# EAGLE schematic SolarTracker-EagleProject (EAGLE 7.7.0)
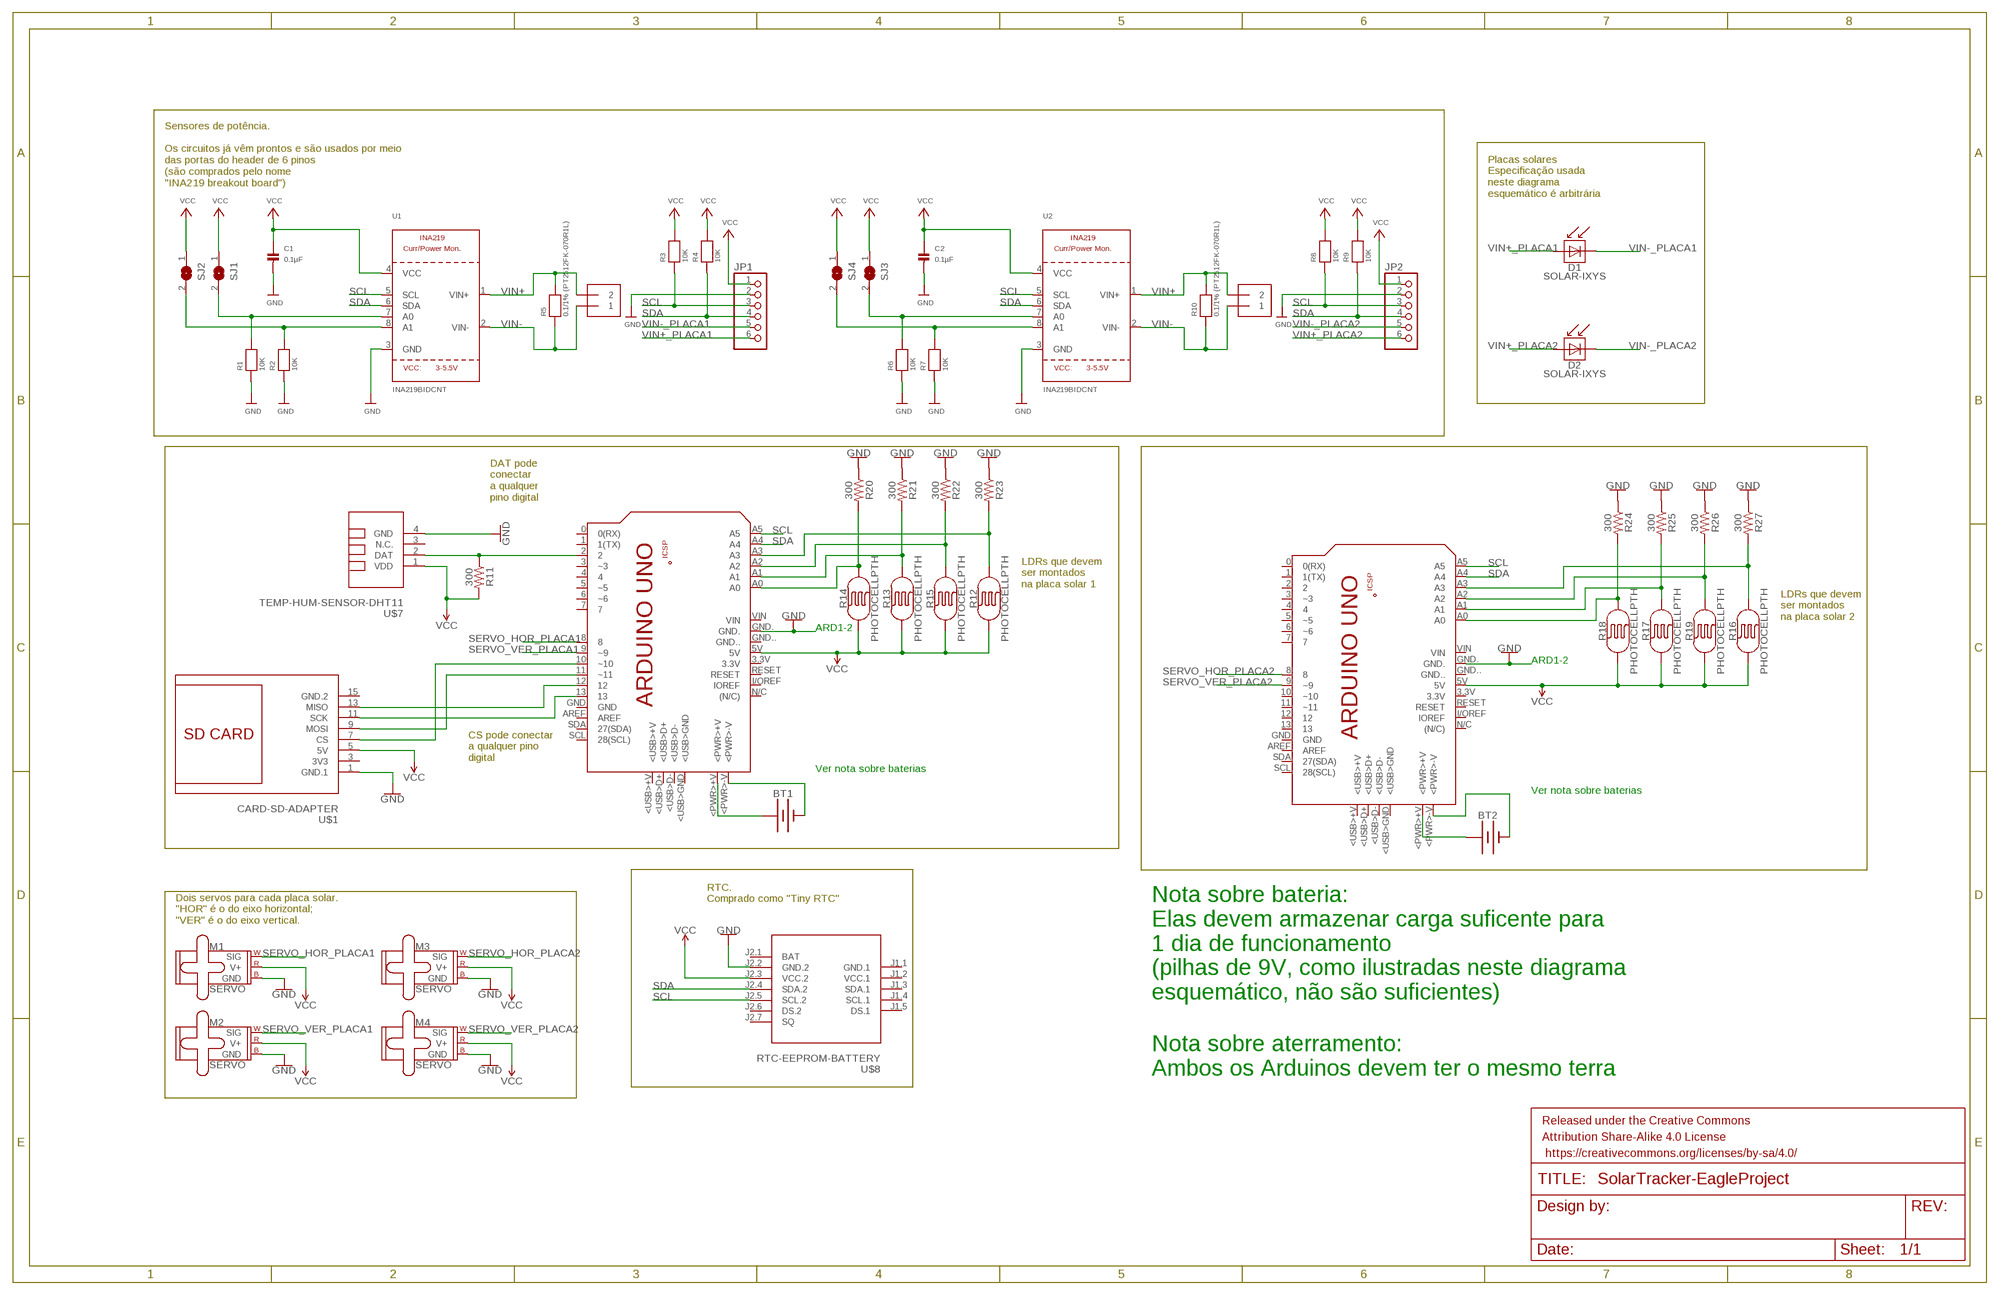
[diagram p0: schematic, sheet 1]

## Parts
BT1  BATTERY-9V  [BATTCON_9V]
BT2  BATTERY-9V  [BATTCON_9V]
C1  0.1µF  CAP_CERAMIC0805  [0805]
C2  0.1µF  CAP_CERAMIC0805  [0805]
D1  SOLAR-IXYS  [SOIC-8]
D2  SOLAR-IXYS  [SOIC-8]
FRAME1  FRAME-LETTER  [CREATIVE_COMMONS]
J1  TERMBLOCK_1X2-3.5MM  [1X2-3.5MM]
J2  TERMBLOCK_1X2-3.5MM  [1X2-3.5MM]
JP1  HEADER-1X670MIL  [1X06_ROUND_70]
JP2  HEADER-1X670MIL  [1X06_ROUND_70]
M1  SERVO  [1X03]
M2  SERVO  [1X03]
M3  SERVO  [1X03]
M4  SERVO  [1X03]
PCB1  ARDUINO_UNO  [ARDUINO_UNO]
PCB2  ARDUINO_UNO  [ARDUINO_UNO]
R1  10K  RESISTOR0805  [0805]
R2  10K  RESISTOR0805  [0805]
R3  10K  RESISTOR0805  [0805]
R4  10K  RESISTOR0805  [0805]
R5  0.1/1% (PT2512FK-070R1L)  RESISTOR2512  [2512]
R6  10K  RESISTOR0805  [0805]
R7  10K  RESISTOR0805  [0805]
R8  10K  RESISTOR0805  [0805]
R9  10K  RESISTOR0805  [0805]
R10  0.1/1% (PT2512FK-070R1L)  RESISTOR2512  [2512]
R11  300  300OHM-0603-1/10W-1%  [0603]
R12  PHOTOCELLPTH  [PHOTOCELL]
R13  PHOTOCELLPTH  [PHOTOCELL]
R14  PHOTOCELLPTH  [PHOTOCELL]
R15  PHOTOCELLPTH  [PHOTOCELL]
R16  PHOTOCELLPTH  [PHOTOCELL]
R17  PHOTOCELLPTH  [PHOTOCELL]
R18  PHOTOCELLPTH  [PHOTOCELL]
R19  PHOTOCELLPTH  [PHOTOCELL]
R20  300  300OHM-0603-1/10W-1%  [0603]
R21  300  300OHM-0603-1/10W-1%  [0603]
R22  300  300OHM-0603-1/10W-1%  [0603]
R23  300  300OHM-0603-1/10W-1%  [0603]
R24  300  300OHM-0603-1/10W-1%  [0603]
R25  300  300OHM-0603-1/10W-1%  [0603]
R26  300  300OHM-0603-1/10W-1%  [0603]
R27  300  300OHM-0603-1/10W-1%  [0603]
SJ1  SOLDERJUMPERREFLOW_NOPASTE  [SOLDERJUMPER_REFLOW_NOPASTE]
SJ2  SOLDERJUMPERREFLOW_NOPASTE  [SOLDERJUMPER_REFLOW_NOPASTE]
SJ3  SOLDERJUMPERREFLOW_NOPASTE  [SOLDERJUMPER_REFLOW_NOPASTE]
SJ4  SOLDERJUMPERREFLOW_NOPASTE  [SOLDERJUMPER_REFLOW_NOPASTE]
U1  INA219BIDCNT  INA219  [SOT23-8]
U2  INA219BIDCNT  INA219  [SOT23-8]
U$1  CARD-SD-ADAPTER  [CARD-SD-ADAPTER]
U$7  TEMP-HUM-SENSOR-DHT11  [TEMP-HUM-SENSOR-DHT11]
U$8  RTC-EEPROM-BATTERY  [RTC-EEPROM-BATTERY]

## Nets
GND: C1.2 C2.2 JP1.2 JP2.2 M1.3(GND) M2.3(GND) M3.3(GND) M4.3(GND) PCB1.GND. PCB2.GND. R1.1 R2.1 R6.1 R7.1 R20.1 R21.1 R22.1 R23.1 R24.1 R25.1 R26.1 R27.1 U1.3(GND) U2.3(GND) U$1.1(GND.1) U$7.4(GND) U$8.J2.2(GND.2)
N$1: R2.2 SJ2.2 U1.8(A1)
N$2: R1.2 SJ1.2 U1.7(A0)
N$3: R7.2 SJ4.2 U2.8(A1)
N$4: R6.2 SJ3.2 U2.7(A0)
N$5: PCB1.13 U$1.11(SCK)
N$6: PCB1.12 U$1.13(MISO)
N$7: PCB1.11(~11) U$1.9(MOSI)
N$8: PCB1.10(~10) U$1.7(CS)
N$9: PCB1.2 R11.1 U$7.2(DAT)
N$10: PCB1.A0 R14.2 R20.2
N$11: PCB1.A1 R13.2 R21.2
N$12: BT2.+ PCB2.<PWR>+V
N$13: BT2.- PCB2.<PWR>-V
N$14: BT1.+ PCB1.<PWR>+V
N$15: BT1.- PCB1.<PWR>-V
N$16: PCB1.A2 R15.2 R22.2
N$17: PCB1.A3 R12.2 R23.2
N$18: PCB2.A0 R18.2 R24.2
N$19: PCB2.A1 R17.2 R25.2
N$20: PCB2.A2 R19.2 R26.2
N$21: PCB2.A3 R16.2 R27.2
SCL: JP1.3 JP2.3 PCB1.A5 PCB2.A5 R3.1 R8.1 U1.5(SCL) U2.5(SCL) U$8.J2.5(SCL.2)
SDA: JP1.4 JP2.4 PCB1.A4 PCB2.A4 R4.1 R9.1 U1.6(SDA) U2.6(SDA) U$8.J2.4(SDA.2)
SERVO_HOR_PLACA1: M1.1(SIG) PCB1.8
SERVO_HOR_PLACA2: M3.1(SIG) PCB2.8
SERVO_VER_PLACA1: M2.1(SIG) PCB1.9(~9)
SERVO_VER_PLACA2: M4.1(SIG) PCB2.9(~9)
VCC: C1.1 C2.1 JP1.1 JP2.1 M1.2(V+) M2.2(V+) M3.2(V+) M4.2(V+) PCB1.5V PCB2.5V R3.2 R4.2 R8.2 R9.2 R11.2 R12.1 R13.1 R14.1 R15.1 R16.1 R17.1 R18.1 R19.1 SJ1.1 SJ2.1 SJ3.1 SJ4.1 U1.4(VCC) U2.4(VCC) U$1.5(5V) U$7.1(VDD) U$8.J2.3(VCC.2)
VIN+: J1.2 J2.2 R5.2 R10.2 U1.1(VIN+) U2.1(VIN+)
VIN+_PLACA1: D1.8(A) JP1.6
VIN+_PLACA2: D2.8(A) JP2.6
VIN-: J1.1 J2.1 R5.1 R10.1 U1.2(VIN-) U2.2(VIN-)
VIN-_PLACA1: D1.5(C) JP1.5
VIN-_PLACA2: D2.5(C) JP2.5
Unconnected: PCB1.0(0(RX)) PCB1.1(1(TX)) PCB1.3(~3) PCB1.3.3V PCB1.4 PCB1.5(~5) PCB1.6(~6) PCB1.7 PCB1.+5V PCB1.<USB>+V PCB1.<USB>D+ PCB1.<USB>D- PCB1.<USB>GND PCB1.AREF PCB1.GND PCB1.GND.. PCB1.GND_ PCB1.I/OREF(IOREF) PCB1.MISO PCB1.MOSI PCB1.N/C((N/C)) PCB1.RESET PCB1.RESET. PCB1.SCK PCB1.SCL(28(SCL)) PCB1.SDA(27(SDA)) PCB1.VIN PCB2.0(0(RX)) PCB2.1(1(TX)) PCB2.2 PCB2.3(~3) PCB2.3.3V PCB2.4 PCB2.5(~5) PCB2.6(~6) PCB2.7 PCB2.10(~10) PCB2.11(~11) PCB2.12 PCB2.13 PCB2.+5V PCB2.<USB>+V PCB2.<USB>D+ PCB2.<USB>D- PCB2.<USB>GND PCB2.AREF PCB2.GND PCB2.GND.. PCB2.GND_ PCB2.I/OREF(IOREF) PCB2.MISO PCB2.MOSI PCB2.N/C((N/C)) PCB2.RESET PCB2.RESET. PCB2.SCK PCB2.SCL(28(SCL)) PCB2.SDA(27(SDA)) PCB2.VIN U$7.3(N.C.) U$8.J1.3(SDA.1) U$8.J1.4(SCL.1) U$8.J1.5(DS.1) U$8.J2.1(BAT) U$8.J2.6(DS.2) U$8.J2.7(SQ)

## Notes on the sheet
- Sensores de potência. 
  
  Os circuitos já vêm prontos e são usados por meio
  das portas do header de 6 pinos 
  (são comprados pelo nome 
  "INA219 breakout board")
- Placas solares
  Especificação usada 
  neste diagrama 
  esquemático é arbitrária
- DAT pode 
  conectar
  a qualquer
  pino digital
- LDRs que devem
  ser montados 
  na placa solar 1
- LDRs que devem
  ser montados 
  na placa solar 2
- ARD1-2
- ARD1-2
- CS pode conectar
  a qualquer pino
  digital
- Ver nota sobre baterias
- Ver nota sobre baterias
- RTC.
  Comprado como "Tiny RTC"
- Dois servos para cada placa solar.
  "HOR" é o do eixo horizontal;
  "VER" é o do eixo vertical.
- Nota sobre bateria: 
  Elas devem armazenar carga suficente para 
  1 dia de funcionamento 
  (pilhas de 9V, como ilustradas neste diagrama
  esquemático, não são suficientes)
- Nota sobre aterramento:
  Ambos os Arduinos devem ter o mesmo terra

## Power pins joined to a net without a drawn wire
3V3: U$1.3(3V3)
GND.1: U$8.J1.1(GND.1)
GND.2: U$1.15(GND.2)
VCC.1: U$8.J1.2(VCC.1)

## Library data of the parts
BT1 BT2 = SparkFun-Batteries:BATTERY: Battery - Single Cell A variety of battery chemistries, sizes, and footprints. Device List: 20MM_PTH - Coin Cell Battery Holder - 20mm (PTH) <https://www.sparkfun.com/products/783> 6.8MM_PTH - Coin Cell Battery Holder - 6.8MM(SMD) <https://www.digikey.com/product-detail/en/seiko-instruments/MS621FE-FL11E/728-1057-ND/1889208?WT.srch=1&gclid=CNOQ5a6LzdQCFZS2wAodXCkE0g> 12MM_SMD - Coin Cell Battery Holder - 12mm (SMD) <https://www.sparkfun.com/products/10592> 12MM_PTH - Coin Cell Battery Holder - 12mm (PTH) <https://www.sparkfun.com/products/7948> 20MM_SMD - 20mm Coin Cell Battery Holder (SMD) (2 legs) Used on the Big Time Watch Kit <https://www.sparkfun.com/products/11734> 20MM_SMD_4LEGS - Coin Cell Battery Holder - 20mm (SMD) <https://www.sparkfun.com/products/11892> 20MM_SMD_4LEGS_OVERPASTE - Coin Cell Battery Holder - 20mm (SMD) <https://www.sparkfun.com/products/11892> (Over-paste on the legs) 24.5MM_PTH - Coin Cell Battery Holder - 24.5mm (PTH) <https://www.sparkfun.com/products/8863> 9V - 9V Battery Holder - PC Mount Used on the SparkFun SparkPunk Sound Kit <https://www.sparkfun.com/products/11177> and SparkFun SparkPunk Sequencer Kit <https://www.sparkfun.com/products/12707> 18650 - Battery Holder - 18650 (PTH) <https://www.sparkfun.com/products/13113> AA - Battery Holder - 1xAA (PTH) <https://www.sparkfun.com/products/7949> AAA - Battery Holder - 1xAAA (PTH) <https://www.sparkfun.com/products/12718> AA_KIT - Battery Holder - 1xAA (PTH) <https://www.sparkfun.com/products/7949> Special kit package - pads only have exposed copper on one side of the board. AAA_KIT - Battery Holder - 1xAAA (PTH) <https://www.sparkfun.com/products/12718> Special kit package - pads only have exposed copper on one side of the board.; PROD_ID: BATT-10855
C1 C2 = microbuilder:CAP_CERAMIC: Ceramic Capacitors 0402 - 0402 Surface Mount Capacitors 16pF 50V 5% [Digikey: 445-4899-2-ND] 18pF 50V 5% [Digikey: 490-1281-2-ND] 22pF 50V 5% [Digikey: 490-1283-2-ND] 68pF 50V 5% [Digikey: 490-1289-2-ND] 0.1uF 10V 10% [Digikey: 490-1318-2-ND] 1.0uF 6.3V 10% [Digikey: 490-1320-2-ND] 0603 - 0603 Surface Mount Capacitors 16 pF 50V 5% [Digikey: 445-5051-2-ND] 22 pF 50V [Digikey: PCC220ACVTR-ND] 33 pF 50V 5% [Digikey: 490-1415-1-ND] 56pF 50V 5% [Digikey: 490-1421-1-ND] 220pF 50V 5% [Digikey: 445-1285-1-ND] 680 pF 50V 2200 pF 50V 5% C0G [Digikey: 445-1297-1-ND] 5600 pF 100V 5% X7R [Digikey: 478-3711-1-ND] 0.1 µF 25V 10% [Digikey: PCC2277TR-ND] 0.22 µF 16V 10% X7R [Digikey: 445-1318-1-ND] 1.0 µF 25V 10% [Digikey: 445-5146-2-ND] 0603 - RF Specific 3pF 250V +/-0.1pF RF [Digikey: 712-1347-1-ND] 18 pF 250V 5% [Digikey: 478-3505-1-ND or 712-1322-1-ND] 56 pF 250V 5% C0G RF [Digikey: 490-4867-1-ND] 68 pF 250V RF [Digikey: 490-4868-1-ND] 0805 - 0805 Surface Mount Capacitors 220 pF 250V 2% RF Ceramic Capacitor [Digikey: 712-1398-1-ND] 1000 pF 50V 2% NP0 Ceramic Capacitor [Digikey: 478-3760-1-ND] 0.1 µF 25V 10% Ceramic Capacitor [Digikey: PCC1828TR-ND] 1.0 µF 16V 10% Ceramic Capacitor[Digikey: 490-1691-2-ND] 10.0 µF 10V 10% Ceramic Capacitor[Digikey: 709-1228-1-ND] 10.0 uF 16V 10% Ceramic Capacitor [Digikey: 478-5165-2-ND] 47 uF 6.3V 20% Ceramic Capacitor [Digikey: 587-1779-1-ND or 399-5506-1-ND] 1206 - 1206 Surface Mount Capacitors 47uF 10V 20% Ceramic Capacitor [Digikey: 490-5528-1-ND or 399-5508-1-ND or 445-6010-1-ND] 100uF 6.3V -20%, +80% Y5V Ceramic Capacitor (Digikey: 490-4512-1-ND, Mouser: 81-GRM31CF50J107ZE1L)
D1 D2 = SparkFun-Sensors:SOLAR-IXYS: IXYS CPC1822 4V Output Solar Cell The CPC1822 is a monolithic photovoltaic string of solar cells with switching circuitry. When operating in sunlight or a bright artificial light environment the optical energy will activate the cell array and generate a voltage at the output. The solar cells are capable of generating a floating source voltage and current sufficient to drive and power CMOS ICs, logic gates and/or provide “trickle charge” for battery applications. Datasheet <https://www.sparkfun.com/datasheets/Prototyping/Solar/CPC1822-1.pdf> SparkFun Products Miniature Solar Cell - CPC1822 <https://www.sparkfun.com/products/9962> (PRT-09962); SF_ID: PRT-09962
FRAME1 = SparkFun-Aesthetics:FRAME-LETTER: Schematic Frame - Letter Standard 8.5x11 US Letter frame
J1 J2 = microbuilder:TERMBLOCK_1X2: 3.5mm Terminal block http://www.ladyada.net/library/pcb/eaglelibrary.html
JP1 JP2 = microbuilder:HEADER-1X6: PIN HEADER
M1-M4 = SparkFun-Electromechanical:SERVO: Servo Motor 3-pin connector for a standard servo motor (voltage supply, ground, and control signal.) SparkFun Products Servo - Generic (Sub-Micro Size) <https://www.sparkfun.com/products/9065> (ROB-09065) Servo - Generic High Torque Continuous Rotation (Standard Size) <https://www.sparkfun.com/products/9347> (ROB-09347) Servo - Generic High Torque (Standard Size) <https://www.sparkfun.com/products/11965> (ROB-11965)
PCB1 PCB2 = E14_Arduino_revC:ARDUINO_UNO: Device for representing an Arduino Uno board with a footprint in an EAGLE design. Created by Dave Young for Element14. More EAGLE documentation at: http://www.element14.com/community/community/knode/cadsoft_eagle
R1-R10 = microbuilder:RESISTOR: Resistors 0402 - 0402 Surface Mount Package 22 Ohm 1% 1/16W [Digikey: 311-22.0LRTR-ND] 33 Ohm 5% 1/16W 1.0K 5% 1/16W 1.5K 5% 1/16W 2.0K 1% 1/16W 10.0K 1% 1/16W [Digikey: 311-10.0KLRTR-ND] 10.0K 5% 1/16W [Digikey: RMCF0402JT10K0TR-ND] 12.1K 1% 1/16W [Digikey: 311-22.0LRTR-ND] 100.0K 5% 1/16W 0603 - 0603 Surface Mount Package 0 Ohm 1/10 Watt 1% Resistor 15 Ohm 1/10 Watt 1% Resistor 33 Ohm 1/10 Watt 1% Resistor 49.9 Ohm 1/10 Watt 1% Resistor 100 Ohm 1/10 Watt 1% Resistor 150 Ohm 1/10 Watt 1% Resistor 240 Ohm 1/10 Watt 1% Resistor 390 Ohm 1/10 Watt 1% Resistor 560 Ohm 1/10 Watt 1% Resistor 680 Ohm 1/10 Watt 1% Resistor 750 Ohm 1/10 Watt 1% Resistor 1.0K Ohm 1/10 Watt 1% Resistor 1.5K Ohm 1/10 Watt 1% Resistor 2.0K Ohm 1/10 Watt 1% Resistor 2.2K Ohm 1/10 Watt 1% Resistor 3.3K Ohm 1/10 Watt 1% Resistor 4.7K Ohm 1/10 Watt 1% Resistor 10.0K Ohm 1/10 Watt 1% Resistor 12.0K Ohm 1/10 Watt 1% Resistor 12.1K Ohm 1/10 Watt 1% Resistor 20.0K Ohm 1/10 Watt 1% Resistor 33.0K Ohm 1/10 Watt 1% Resistor 100.0K Ohm 1/10 Watt 1% Resistor 0805 - 0805 Surface Mount Package 0 Ohm 1/8 Watt 1% Resistor 33 Ohm 1/8 Watt 1% Resistor 100 Ohm 1/8 Watt 1% Resistor 150 Ohm 1/8 Watt 1% Resistor 200 Ohm 1/8 Watt 1% Resistor 240 Ohm 1/8 Watt 1% Resistor 330 Ohm 1/8 Watt 1% Resistor 390 Ohm 1/8 Watt 1% Resistor 470 Ohm 1/8 Watt 1% Resistor 1.0K Ohm 1/8 Watt 1% Resistor 1.5K Ohm 1/8 Watt 1% Resistor 2.0K Ohm 1/8 Watt 1% Resistor 4.7K Ohm 1/8 Watt 1% Resistor 5.1K Ohm 1/8 Watt 1% Resistor 5.6K Ohm 1/8 Watt 1% Resistor 10.0K Ohm 1/8 Watt 1% Resistor 22.0K Ohm 1/8 Watt 1% Resistor 33.0K Ohm 1/8 Watt 1% Resistor 100K Ohm 1/8 Watt 1% Resistor 1206 - 1206 Surface Mount Package 2012 - 2010 Surface Mount Package 0.11 Ohm 1/2 Watt 1% Resistor - Digikey: RHM.11UCT-ND
R11 R20-R27 = SparkFun-Resistors:300OHM: 300Ω resistor A resistor is a passive two-terminal electrical component that implements electrical resistance as a circuit element. Resistors act to reduce current flow, and, at the same time, act to lower voltage levels within circuits. - Wikipedia; PROD_ID: RES_10328
R12-R19 = SparkFun-Sensors:PHOTOCELL: Photocell (Photodetector, Photo Resistor, CdS) This is a very small light sensor. A photocell changes (also called a photodetector, photo resistor, CdS or photoconductive cell) resistance depending on the amount of light it is exposed to. These little sensors make great ambient light triggers (when light in the room turns on, do something). Datasheet <http://cdn.sparkfun.com/datasheets/Sensors/LightImaging/SEN-09088.pdf> SparkFun Products Mini Photocell <https://www.sparkfun.com/products/9088> (SEN-09088); PROD_ID: COMP-09129; SF_ID: SEN-09088
SJ1-SJ4 = microbuilder:SOLDERJUMPER: SMD Solder JUMPER Solder the two pads together to create a connection, or remove the solder to break it. REFLOW - Use this footprint for solder paste and reflow ovens. WAVE - Use this footprint for hand-soldering (larger pads). CLOSED - Has a trace between the two pads to ensure it is closed by default. The trace needs to be cut to disable the jumper, and can be closed again by creating a solder bridge between the two pads.
U1 U2 = microbuilder:INA219: INA219 - I2C Current/Power Monitor Voltage Range: 0-26V Accuracy: 0.5% Temperature: -40°C - 125°C
U$1 = diy-modules:CARD-SD-ADAPTER: Full Size SD Card Adapter Module with onboard 3.3V regulator Guide describing how to use SD card with Arduino is available here: https://www.arduino.cc/en/Reference/SDCardNotes Click here to find device on ebay.com <http://www.ebay.com/sch/sd+card+socket+module>
U$7 = diy-modules:TEMP-HUM-SENSOR-DHT11: DHT11 - digital humidity & temperature sensor DHT11 datasheet available here: https://akizukidenshi.com/download/ds/aosong/DHT11.pdf Click here to find device on ebay.com <http://www.ebay.com/sch/dht11+digital+sensor>
U$8 = diy-modules:RTC-EEPROM-BATTERY: RTC Module with Battery and EEPROM based on DS1307 and AT24C32 chips More details available here: http://henrysbench.capnfatz.com/henrys-bench/arduino-sensors-and-input/arduino-tiny-rtc-d1307-tutorial/ Click here to find device on ebay.com <http://www.ebay.com/sch/tiny+rtc+arduino>